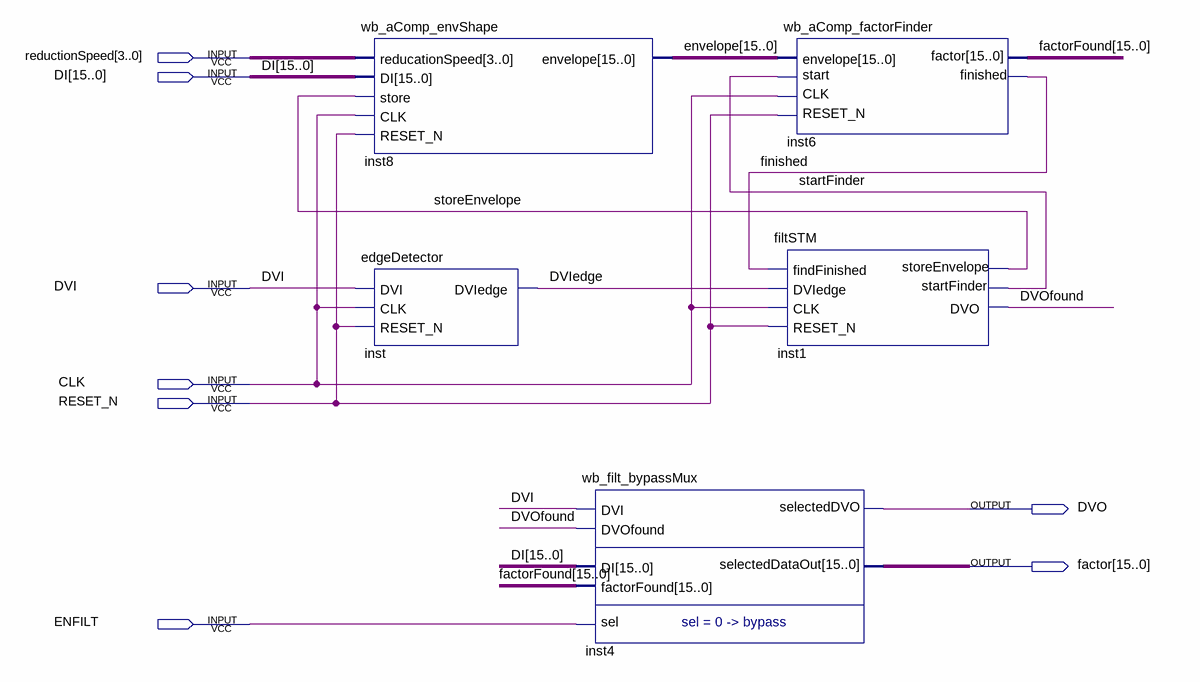
[diagram p0: schematic sheet]
// Quartus schematic filt.bdf as structural Verilog: 5 symbols, 8 pins
module filt (
  input  [3:0] reductionSpeed,
  input  [15:0] DI,
  input  DVI,
  input  CLK,
  input  RESET_N,
  input  ENFILT,
  output DVO,
  output [15:0] factor
);

  wire DVIedge, DVOfound, finished, startFinder, storeEnvelope;
  wire [15:0] envelope, factorFound;

  wb_aComp_envShape inst8 (
    .reducationSpeed(reductionSpeed), .DI(DI), .CLK(CLK), .store(storeEnvelope), .RESET_N(RESET_N),
    .envelope(envelope));
  edgeDetector inst (.DVI(DVI), .CLK(CLK), .RESET_N(RESET_N), .DVIedge(DVIedge));
  wb_filt_bypassMux inst4 (
    .sel(ENFILT), .DVI(DVI), .DVOfound(DVOfound), .factorFound(factorFound), .DI(DI), .selectedDVO(DVO),
    .selectedDataOut(factor));
  wb_aComp_factorFinder inst6 (
    .RESET_N(RESET_N), .CLK(CLK), .start(startFinder), .envelope(envelope), .factor(factorFound),
    .finished(finished));
  filtSTM inst1 (
    .findFinished(finished), .DVIedge(DVIedge), .CLK(CLK), .RESET_N(RESET_N), .startFinder(startFinder),
    .DVO(DVOfound), .storeEnvelope(storeEnvelope));
endmodule
